# EasyEDA schematic sheet.json
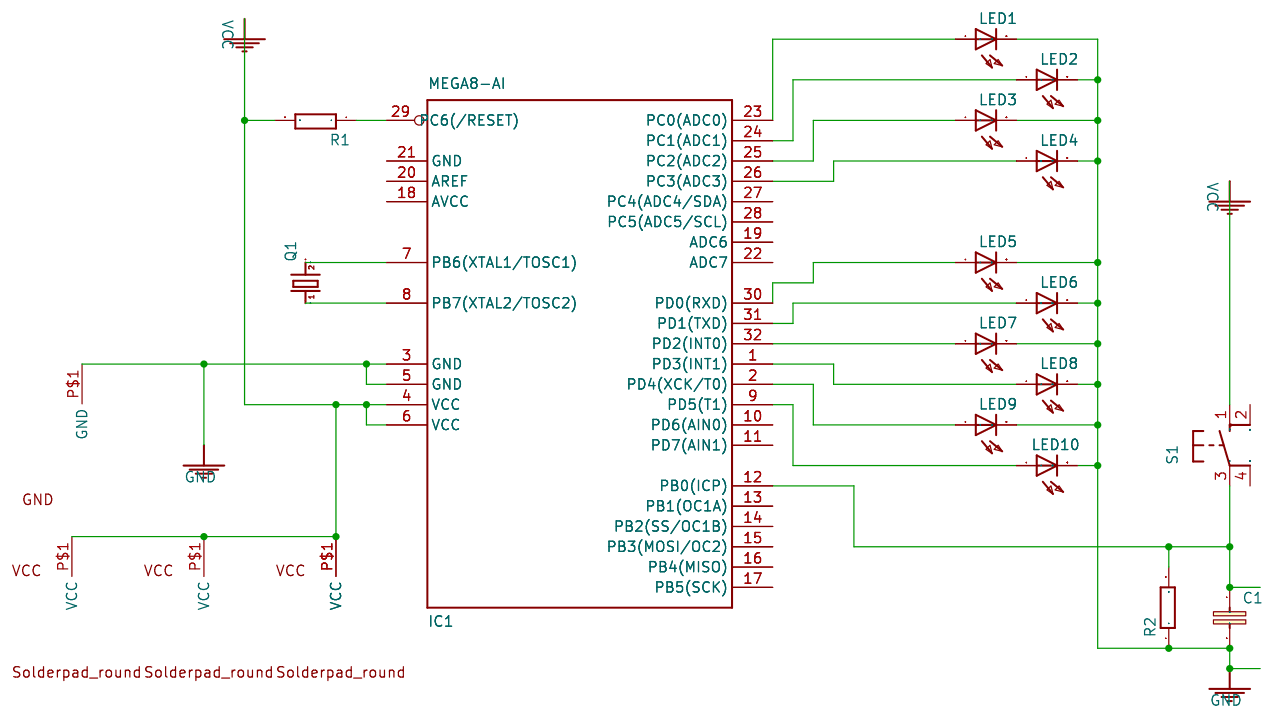
[diagram p0: schematic sheet]

## Parts
C1  C-EUC0805  [C0805]
IC1  MEGA8-AI  [TQFP32-08]
LED1  LEDCHIP-LED0805  [CHIP-LED0805]
LED2  LEDCHIP-LED0805  [CHIP-LED0805]
LED3  LEDCHIP-LED0805  [CHIP-LED0805]
LED4  LEDCHIP-LED0805  [CHIP-LED0805]
LED5  LEDCHIP-LED0805  [CHIP-LED0805]
LED6  LEDCHIP-LED0805  [CHIP-LED0805]
LED7  LEDCHIP-LED0805  [CHIP-LED0805]
LED8  LEDCHIP-LED0805  [CHIP-LED0805]
LED9  LEDCHIP-LED0805  [CHIP-LED0805]
LED10  LEDCHIP-LED0805  [CHIP-LED0805]
Q1  CRYSTALTC26H  [TC26H]
R1  R-EU_R0805  [R0805]
R2  R-EU_R0805  [R0805]
S1  10-XX  [B3F-10XX]
U$1  VCC_PLATE  [VCC_PLATE]
U$2  VCC_PLATE  [VCC_PLATE]
U$3  GND_PLATE  [GND_PLATE]
U$4  VCC_PLATE  [VCC_PLATE]

## Nets
GND: C1.2 IC1.3(GND) IC1.5(GND) LED1.C LED2.C LED3.C LED4.C LED5.C LED6.C LED7.C LED8.C LED9.C LED10.C R2.1 U$3.P$1(GND)
VCC: IC1.4(VCC) IC1.6(VCC) R1.2 S1.1(S) U$1.P$1(VCC) U$2.P$1(VCC) U$4.P$1(VCC)
Net-(C1-1): C1.1 IC1.12(PB0(ICP)) R2.2 S1.3(P)
Net-(IC1-1): IC1.1(PD3(INT1)) LED8.A
Net-(IC1-2): IC1.2(PD4(XCK/T0)) LED9.A
Net-(IC1-7): IC1.7(PB6(XTAL1/TOSC1)) Q1.2
Net-(IC1-8): IC1.8(PB7(XTAL2/TOSC2)) Q1.1
Net-(IC1-9): IC1.9(PD5(T1)) LED10.A
Net-(IC1-23): IC1.23(PC0(ADC0)) LED1.A
Net-(IC1-24): IC1.24(PC1(ADC1)) LED2.A
Net-(IC1-25): IC1.25(PC2(ADC2)) LED3.A
Net-(IC1-26): IC1.26(PC3(ADC3)) LED4.A
Net-(IC1-29): IC1.29(PC6(/RESET)) R1.1
Net-(IC1-30): IC1.30(PD0(RXD)) LED5.A
Net-(IC1-31): IC1.31(PD1(TXD)) LED6.A
Net-(IC1-32): IC1.32(PD2(INT0)) LED7.A

Not connected (* = marked no-connect by the designer): IC1 10(PD6(AIN0)) 11(PD7(AIN1)) 13(PB1(OC1A)) 14(PB2(SS/OC1B)) 15(PB3(MOSI/OC2)) 16(PB4(MISO)) 17(PB5(SCK)) 18(AVCC) 19(ADC6) 20(AREF) 21(GND) 22(ADC7) 27(PC4(ADC4/SDA)) 28(PC5(ADC5/SCL)); S1 2(S1) 4(P1)
